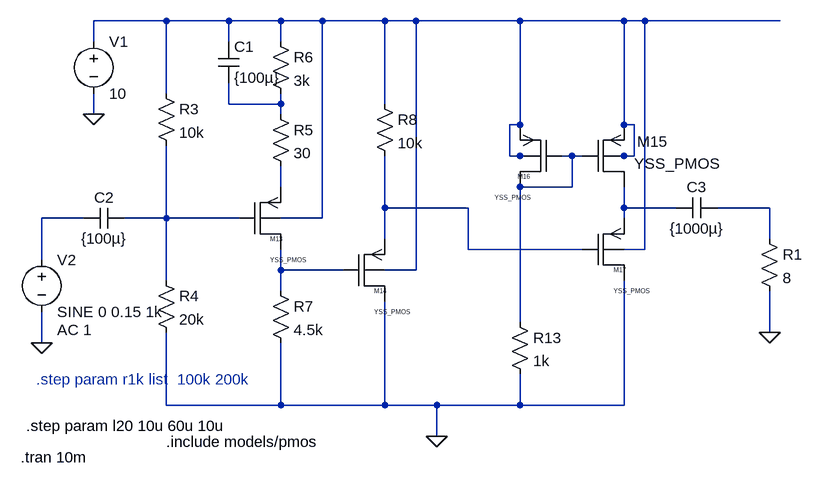
[diagram p0: schematic amp_haruna_mchange.asc]
amp_haruna_mchange.asc, the LTspice schematic file:
Version 4
SHEET 1 1492 1136
WIRE -1040 448 -1152 448
WIRE -944 448 -1040 448
WIRE -864 448 -944 448
WIRE -800 448 -864 448
WIRE -704 448 -800 448
WIRE -656 448 -704 448
WIRE -496 448 -656 448
WIRE -336 448 -496 448
WIRE -304 448 -336 448
WIRE -96 448 -304 448
WIRE -1152 480 -1152 448
WIRE -944 480 -944 448
WIRE -864 480 -864 448
WIRE -1040 560 -1040 448
WIRE -944 576 -944 544
WIRE -864 576 -864 560
WIRE -864 576 -944 576
WIRE -704 576 -704 448
WIRE -1152 592 -1152 560
WIRE -864 592 -864 576
WIRE -496 608 -496 448
WIRE -496 608 -512 608
WIRE -336 608 -336 448
WIRE -320 608 -336 608
WIRE -512 656 -512 608
WIRE -496 656 -512 656
WIRE -480 656 -496 656
WIRE -416 656 -432 656
WIRE -400 656 -416 656
WIRE -336 656 -352 656
WIRE -320 656 -320 608
WIRE -320 656 -336 656
WIRE -864 704 -864 672
WIRE -416 704 -416 656
WIRE -416 704 -496 704
WIRE -704 736 -704 656
WIRE -576 736 -704 736
WIRE -336 736 -336 704
WIRE -256 736 -336 736
WIRE -112 736 -192 736
WIRE -1168 752 -1232 752
WIRE -1040 752 -1040 640
WIRE -1040 752 -1104 752
WIRE -928 752 -1040 752
WIRE -800 752 -800 448
WIRE -800 752 -864 752
WIRE -336 752 -336 736
WIRE -704 784 -704 736
WIRE -112 784 -112 736
WIRE -576 800 -576 736
WIRE -400 800 -576 800
WIRE -304 800 -304 448
WIRE -304 800 -336 800
WIRE -1232 816 -1232 752
WIRE -864 832 -864 800
WIRE -768 832 -864 832
WIRE -656 832 -656 448
WIRE -656 832 -704 832
WIRE -1040 848 -1040 752
WIRE -864 864 -864 832
WIRE -496 912 -496 704
WIRE -112 928 -112 864
WIRE -1232 944 -1232 896
WIRE -1040 1040 -1040 928
WIRE -864 1040 -864 944
WIRE -864 1040 -1040 1040
WIRE -704 1040 -704 880
WIRE -704 1040 -864 1040
WIRE -624 1040 -704 1040
WIRE -496 1040 -496 992
WIRE -496 1040 -624 1040
WIRE -336 1040 -336 848
WIRE -336 1040 -496 1040
WIRE -624 1088 -624 1040
FLAG -1152 592 0
FLAG -1232 944 0
FLAG -624 1088 0
FLAG -112 928 0
SYMBOL PMOS@YSS_PMOS -928 752 R0
SYMATTR InstName M13
SYMATTR Value2 l=10u w=100u m=270
SYMBOL res -1056 544 R0
SYMATTR InstName R3
SYMATTR Value 10k
SYMBOL res -1056 832 R0
SYMATTR InstName R4
SYMATTR Value 20k
SYMBOL res -880 576 R0
SYMATTR InstName R5
SYMATTR Value 30
SYMBOL res -880 464 R0
SYMATTR InstName R6
SYMATTR Value 3k
SYMBOL res -880 848 R0
SYMATTR InstName R7
SYMATTR Value 4.5k
SYMBOL PMOS@YSS_PMOS -768 832 R0
SYMATTR InstName M14
SYMATTR Value2 l=10u w=100u m=18
SYMBOL res -720 560 R0
SYMATTR InstName R8
SYMATTR Value 10k
SYMBOL PMOS@YSS_PMOS -400 656 R0
WINDOW 0 84 -22 Left 2
WINDOW 3 80 12 Left 2
SYMATTR InstName M15
SYMATTR Value2 l=10u w=100u m=450
SYMBOL PMOS@YSS_PMOS -432 656 M0
SYMATTR InstName M16
SYMATTR Value2 l=10u w=100u m=18
SYMBOL res -512 896 R0
SYMATTR InstName R13
SYMATTR Value 1k
SYMBOL PMOS@YSS_PMOS -400 800 R0
SYMATTR InstName M17
SYMATTR Value2 l=10u w=100u m=450
SYMBOL cap -960 480 R0
SYMATTR InstName C1
SYMATTR Value {100µ}
SYMBOL cap -1104 736 R90
WINDOW 0 0 32 VBottom 2
WINDOW 3 32 32 VTop 2
SYMATTR InstName C2
SYMATTR Value {100µ}
SYMBOL cap -192 720 R90
WINDOW 0 0 32 VBottom 2
WINDOW 3 32 32 VTop 2
SYMATTR InstName C3
SYMATTR Value {1000µ}
SYMBOL voltage -1152 464 R0
WINDOW 123 0 0 Left 2
WINDOW 39 0 0 Left 2
SYMATTR InstName V1
SYMATTR Value 10
SYMBOL voltage -1232 800 R0
WINDOW 123 24 124 Left 2
WINDOW 39 0 0 Left 2
SYMATTR Value2 AC 1
SYMATTR InstName V2
SYMATTR Value SINE 0 0.15 1k
SYMBOL res -128 768 R0
SYMATTR InstName R1
SYMATTR Value 8
TEXT -1240 1000 Left 2 ;.step param r1k list  100k 200k
TEXT -1040 1096 Left 2 !.include models/pmos
TEXT -1264 1120 Left 2 !.tran 10m
TEXT -1256 1072 Left 2 !.step param l20 10u 60u 10u

The netlist it stands for:
* amp_haruna_mchange.asc
M13 N010 N009 N004 N001 YSS_PMOS l=10u w=100u m=270
R3 N001 N009 10k
R4 N009 0 20k
R5 N002 N004 30
R6 N001 N002 3k
R7 N010 0 4.5k
M14 0 N010 N005 N001 YSS_PMOS l=10u w=100u m=18
R8 N001 N005 10k
M15 N006 N003 N001 N001 YSS_PMOS l=10u w=100u m=450
M16 N003 N003 N001 N001 YSS_PMOS l=10u w=100u m=18
R13 N003 0 1k
M17 0 N005 N006 N001 YSS_PMOS l=10u w=100u m=450
C1 N001 N002 {100µ}
C2 N009 N008 {100µ}
C3 N007 N006 {1000µ}
V1 N001 0 10
V2 N008 0 SINE 0 0.15 1k AC 1
R1 N007 0 8
.model NMOS NMOS
.model PMOS PMOS
.lib standard.mos
* .step param r1k list  100k 200k
.include models/pmos
.tran 10m
.step param l20 10u 60u 10u
.backanno
.end